# EAGLE schematic ground_station_boardv1.1 (EAGLE 9.6.2)
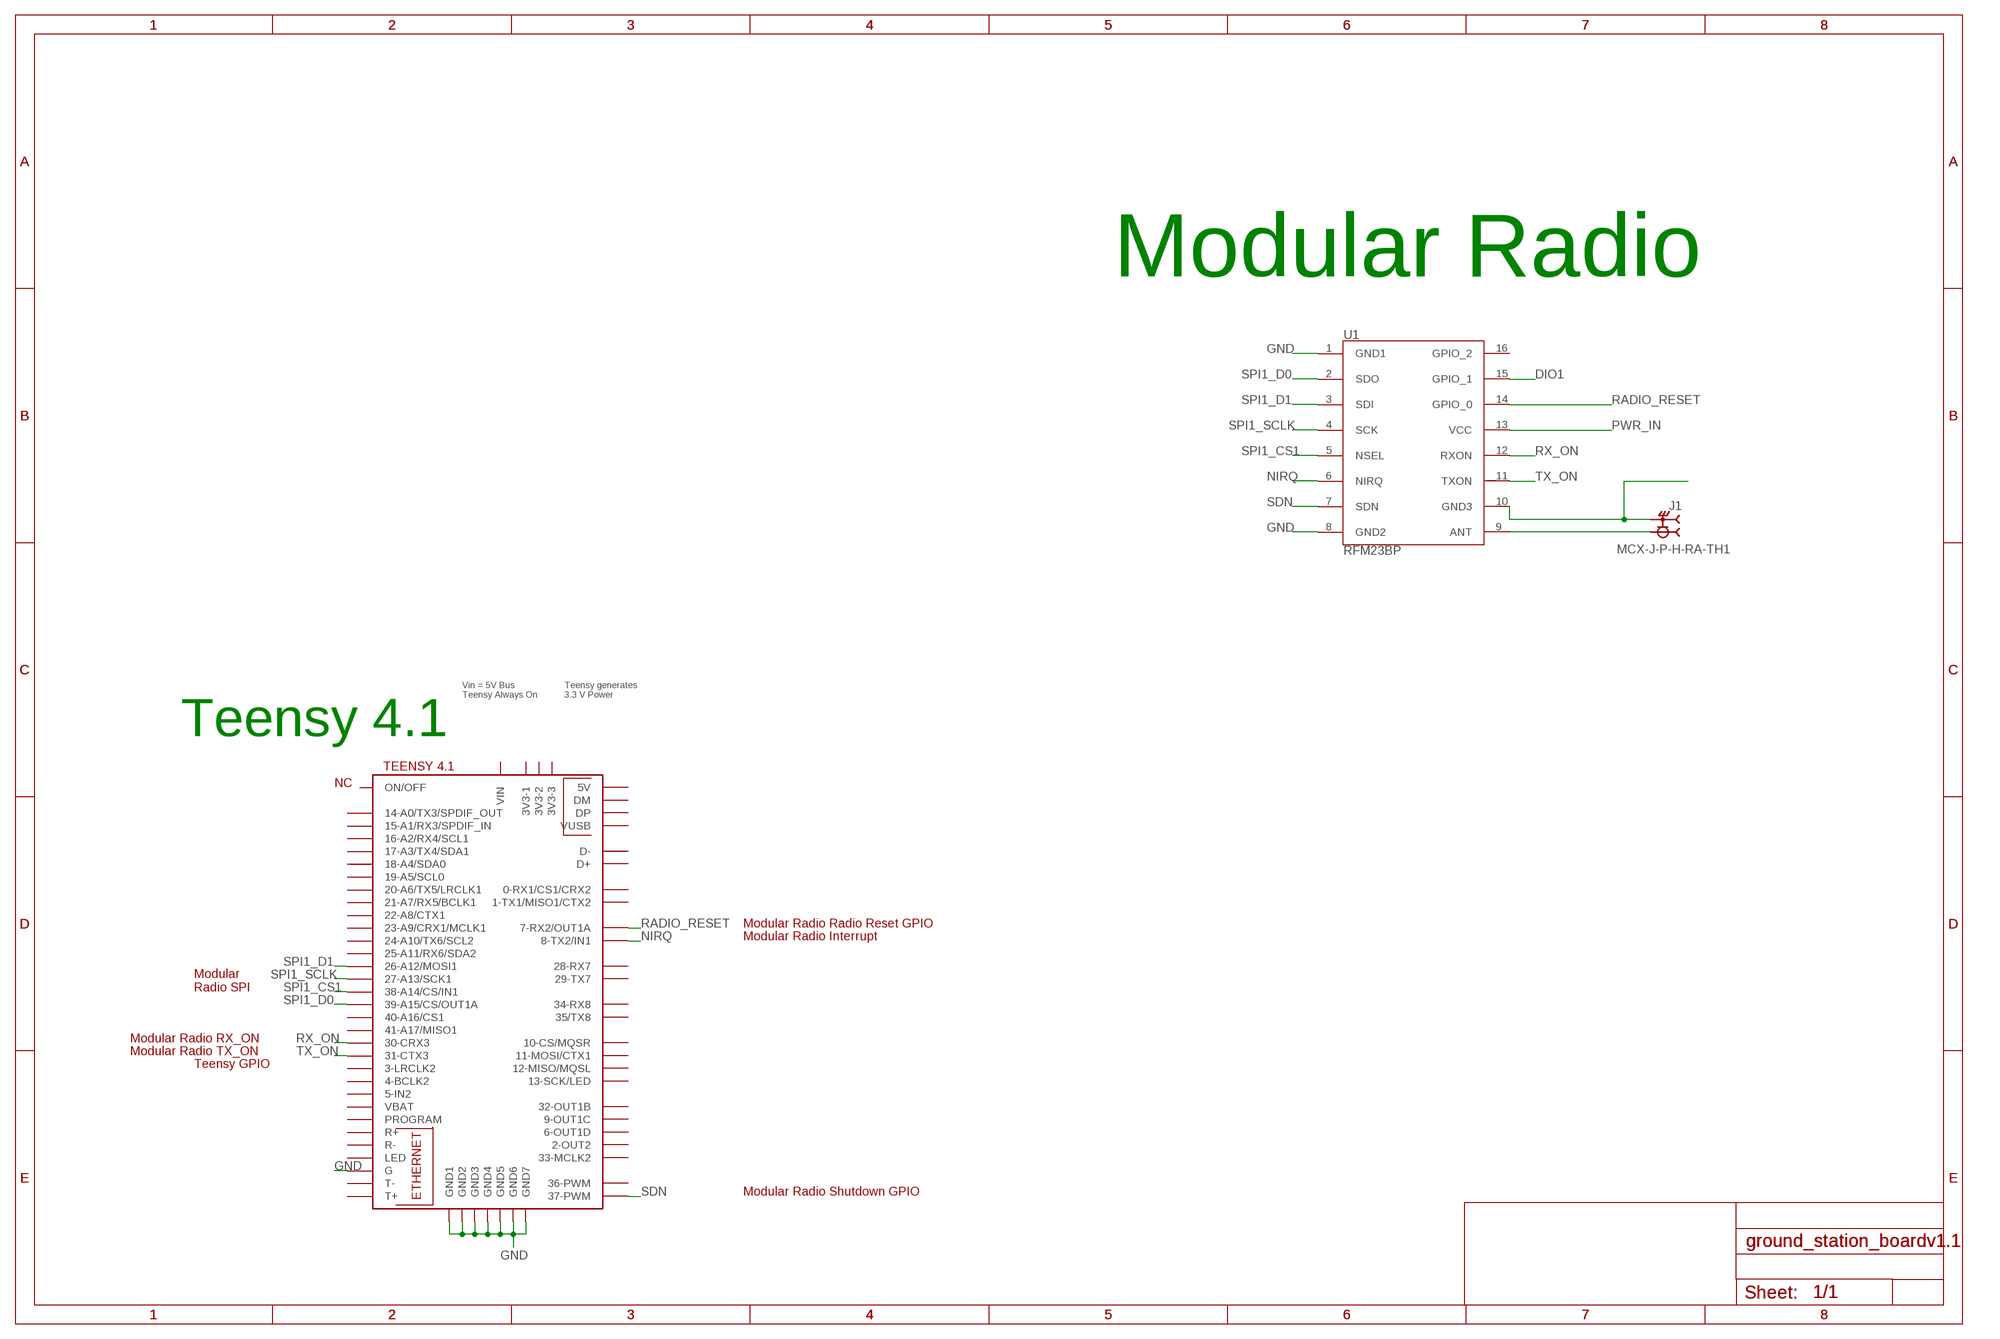
[diagram p0: schematic, sheet 1]

## Parts
J1  MCX-J-P-H-RA-TH1  [SAMTEC_MCX-J-P-H-RA-TH1]
U1  RFM23BP  [RFM23BP]
U$1  TEENSY41TEENSY  [TEENSY41]

## Nets
DIO1: U1.15(GPIO_1)
GND: U1.1(GND1) U1.8(GND2) U$1.G U$1.GND1 U$1.GND2 U$1.GND3 U$1.GND4 U$1.GND5 U$1.GND6 U$1.GND(GND7)
N$1: J1.1 U1.9(ANT)
NIRQ: U1.6(NIRQ) U$1.8-TX2/IN1
PWR_IN: U1.13(VCC)
RADIO_RESET: U1.14(GPIO_0) U$1.7-RX2/OUT1A
RF_GND: J1.S1 J1.S2 J1.S3 J1.S4 U1.10(GND3)
RX_ON: U1.12(RXON) U$1.30-CRX3
SDN: U1.7(SDN) U$1.37-PWM
SPI1_CS1: U1.5(NSEL) U$1.38-A14/CS/IN1
SPI1_D0: U1.2(SDO) U$1.39-A15/CS/OUT1A
SPI1_D1: U1.3(SDI) U$1.26-A12/MOSI1
SPI1_SCLK: U1.4(SCK) U$1.27-A13/SCK1
TX_ON: U1.11(TXON) U$1.31-CTX3
Unconnected: U1.16(GPIO_2) U$1.0-RX1/CS1/CRX2 U$1.1-TX1/MISO1/CTX2 U$1.2-OUT2 U$1.3-LRCLK2 U$1.3V3-1 U$1.3V3-2 U$1.3V3-3 U$1.4-BCLK2 U$1.5-IN2 U$1.6-OUT1D U$1.9-OUT1C U$1.10-CS\MQSR(10-CS/MQSR) U$1.11-MOSI/CTX1 U$1.12-MISO/MQSL U$1.13-SCK/LED U$1.14-A0/TX3/SPDIF_OUT U$1.15-A1/RX3/SPDIF_IN U$1.16-A2/RX4/SCL1 U$1.17-A3/TX4/SDA1 U$1.18-A4/SDA0 U$1.19-A5/SCL0 U$1.20-A6/TX5/LRCLK1 U$1.21-A7/RX5/BCLK1 U$1.22-A8/CTX1 U$1.23-A9/CRX1/MCLK1 U$1.24-A10/TX6/SCL2 U$1.25-A11/RX6/SDA2 U$1.28-RX7 U$1.29-TX7 U$1.32-OUT1B U$1.33-MCLK2 U$1.34-RX8 U$1.35-TX8(35/TX8) U$1.36-PWM U$1.40-A16/CS1 U$1.41-A17/MISO1 U$1.+5V(5V) U$1.D+ U$1.D- U$1.DM U$1.DP U$1.LED U$1.ON/OFF U$1.PROGRAM U$1.R+ U$1.R- U$1.T+ U$1.T- U$1.VBAT U$1.VIN U$1.VUSB

## Notes on the sheet
- Modular Radio
- Vin = 5V Bus 
  Teensy Always On
- Teensy generates 
  3.3 V Power
- Teensy 4.1
- NC
- Modular Radio Radio Reset GPIO
- Modular Radio Interrupt
- Modular 
  Radio SPI
- Modular Radio RX_ON
- Modular Radio TX_ON
- Teensy GPIO
- Modular Radio Shutdown GPIO

## Library data of the parts
J1 = OBCv4:MCX-J-P-H-RA-TH1: 50 Ohm MCX Jack or Plug, Through-hole; DESCRIPTION: MCX Connector Jack, Female Socket 50Ohm Through Hole, Right Angle Solder; DIGI-KEY_PART_NUMBER: SAM10607-ND; MF: Samtec; MP: MCX-J-P-H-RA-TH1; PACKAGE: None; PURCHASE-URL: https://pricing.snapeda.com/search/part/MCX-J-P-H-RA-TH1/?ref=eda
U1 = RFM RADIOS:RFM23BP
U$1 = OBCv4:TEENSY41

## Net classes
1 highpower: width 0.406 mm, drill 0.483 mm
2 lowpower: width 0.305 mm, drill 0.483 mm